# EAGLE design rfm12-breakout (EAGLE 6.5.0)
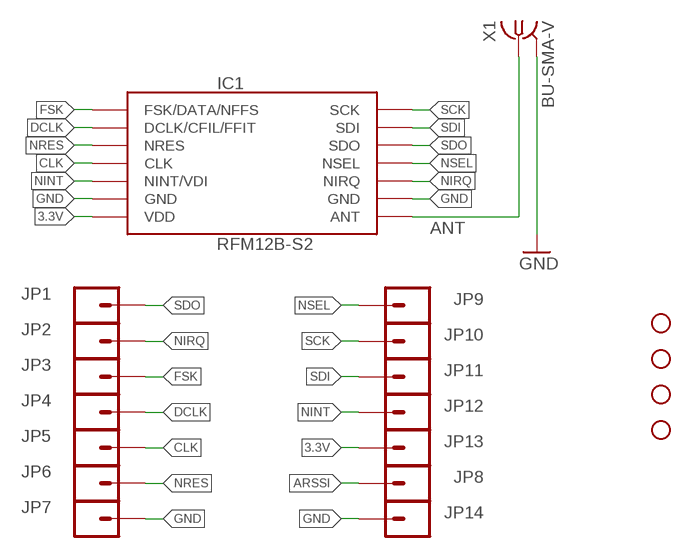
[diagram p0: schematic, sheet 1]

## Parts
IC1  RFM12B-S2  [RFM12B-S2]
JP1  M01  [1X01]
JP2  M01  [1X01]
JP3  M01  [1X01]
JP4  M01  [1X01]
JP5  M01  [1X01]
JP6  M01  [1X01]
JP7  M01  [1X01]
JP8  M01  [1X01]
JP9  M01  [1X01]
JP10  M01  [1X01]
JP11  M01  [1X01]
JP12  M01  [1X01]
JP13  M01  [1X01]
JP14  M01  [1X01]
STANDOFF1  STAND-OFF  [STAND-OFF]
STANDOFF2  STAND-OFF  [STAND-OFF]
STANDOFF3  STAND-OFF  [STAND-OFF]
STANDOFF4  STAND-OFF  [STAND-OFF]
X1  BU-SMA-V  [BU-SMA-V]

## Nets
3.3V: IC1.VDD JP13.1
ANT: IC1.ANT X1.1
ARSSI: JP8.1
CLK: IC1.CLK JP5.1
DCLK: IC1.DCLK/CFIL/FFIT JP4.1
FSK: IC1.FSK/DATA/NFFS JP3.1
GND: IC1.GND@1(GND) IC1.GND@2(GND) JP7.1 JP14.1 X1.2 X1.3 X1.4 X1.5
NINT: IC1.NINT/VDI JP12.1
NIRQ: IC1.NIRQ JP2.1
NRES: IC1.NRES JP6.1
NSEL: IC1.NSEL JP9.1
SCK: IC1.SCK JP10.1
SDI: IC1.SDI JP11.1
SDO: IC1.SDO JP1.1

## Library data of the parts
IC1 = Justin:RFM12B-S2
JP1-JP14 = Justin:M01
STANDOFF1-STANDOFF4 = SparkFun-Electromechanical:STAND-OFF: #4 Stand Off This is the mechanical footprint for a #4 phillips button head screw. Use the keepout ring to avoid running the screw head into surrounding components. SKU : PRT-00447
X1 = Justin:BU-SMA-V: FEMALE SMA CONNECTOR Radiall distributor RS 112-3794; OC_FARNELL: unknown; OC_NEWARK: unknown

## Board
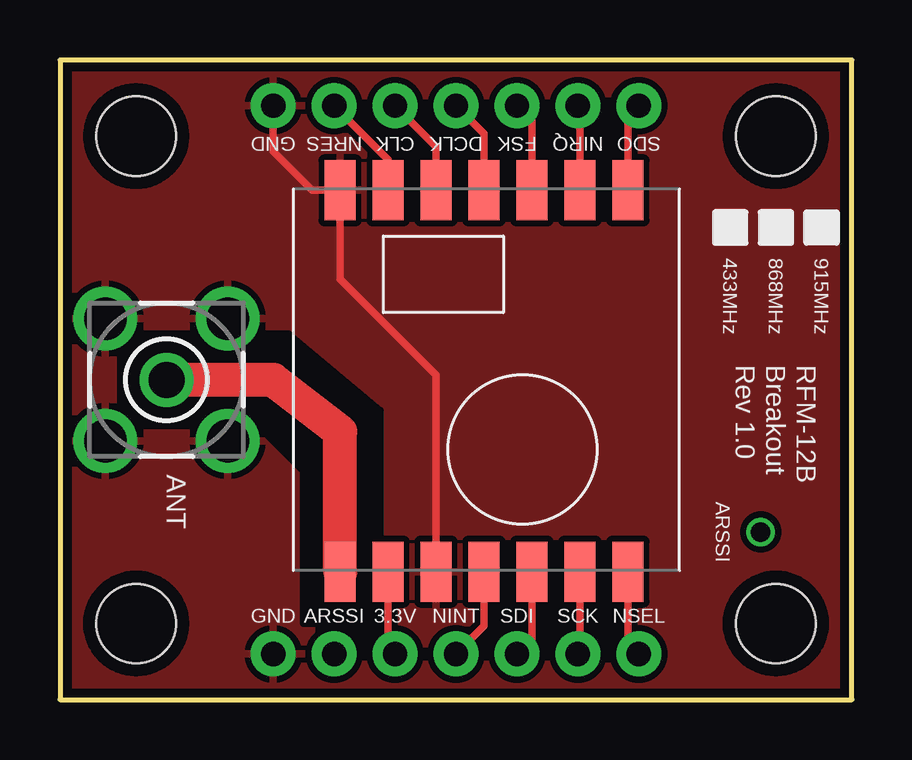
[diagram p1: board, top side]
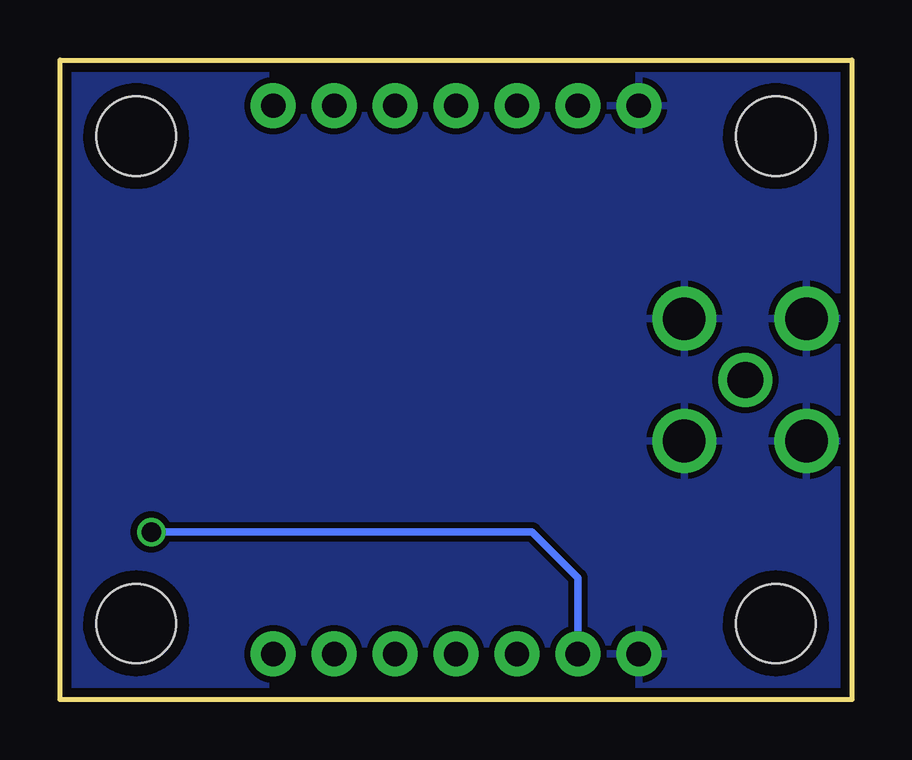
[diagram p2: board, bottom side, seen from below]

Size 33.02 x 26.67 mm. Coordinates in mm from the lower left corner, seen from the top.
Outline: 0,26.67 0,0 33.02,0 33.02,26.67 0,26.67
Copper layers (1*16): Top 0.0356mm / dielectric 1.5011mm / Bottom 0.0356mm
Design rules "LaenPCBOrder": minimum track width 6mil, minimum drill 13mil, track to track 6mil, track to pad 6mil, pad to pad 6mil, via to via 6mil, smd to smd 6mil, copper to edge 15mil, drill to drill 6mil, minimum pad ring 7mil, minimum via ring 7mil, stop-mask expansion 4mil, vias tented up to drill 0mil, thermal gap 10mil

### Footprints (pad centres in the part's own frame; a part is rotated, then mirrored left to right if it is on the bottom)
RFM12B-S2 = smd 2.5 x 1.3: ANT 8,-6.1; CLK -7.9,-2.1; DCLK/CFIL/FFIT -7.9,-0.1; FSK/DATA/NFFS -7.9,1.9; GND@1 -7.9,-6.1; GND@2 8,-2.1; NINT/VDI 8,-0.1; NIRQ -7.9,3.9; NRES -7.9,-4.1; NSEL 8,5.9; SCK 8,3.9; SDI 8,1.9; SDO -7.9,5.9; VDD 8,-4.1
1X01 = drill 1.016 pad 1.88: 1 0,0
STAND-OFF = hole 3.302: 0,0
BU-SMA-V = drill 1.5: 1 0,0 | drill 1.778: 2 -2.55,2.55; 3 2.55,2.55; 4 2.55,-2.55; 5 -2.55,-2.55

### Placement (x,y rotation side)
IC1  17.78,13.34 270 top
JP1  24.13,24.77 270 top
JP2  21.59,24.77 270 top
JP3  19.05,24.77 270 top
JP4  16.51,24.77 270 top
JP5  13.97,24.77 270 top
JP6  11.43,24.77 270 top
JP7  8.89,24.77 270 top
JP8  11.43,1.91 270 top
JP9  24.13,1.91 270 top
JP10  21.59,1.91 270 top
JP11  19.05,1.91 270 top
JP12  16.51,1.91 270 top
JP13  13.97,1.91 270 top
JP14  8.89,1.91 270 top
STANDOFF1  3.17,23.5 270 top
STANDOFF2  3.17,3.17 270 top
STANDOFF3  29.84,3.17 270 top
STANDOFF4  29.84,23.5 270 top
X1  4.45,13.34 270 top

### Tracks (layer width: path | path; a pad name or v marks a point on that pad's centre or on a via)
3.3V
  Top 0.305: IC1.VDD 13.68,2.19 JP13.1
ANT
  Top 1.422: IC1.ANT 11.68,11.18 8.89,13.34 X1.1
ARSSI  (via drill 0.8)
  Bottom 0.305: JP8.1 11.43,5.08 13.34,6.99 v29.21,6.99
CLK
  Top 0.305: IC1.CLK 15.68,23.05 JP5.1
DCLK
  Top 0.305: IC1.DCLK/CFIL/FFIT 17.68,23.59 JP4.1
FSK
  Top 0.305: IC1.FSK/DATA/NFFS 19.68,24.14 JP3.1
GND
  Top 0.305: IC1.GND@2 15.68,13.53 11.68,17.53 IC1.GND@1 10.52,21.23 8.89,22.86 JP7.1
  pour Bottom (isolate 0.254): 33.02,26.67 0,26.67 0,0 33.02,0
  pour Top (isolate 0.254): 33.02,26.67 0,26.67 0,0 33.02,0
N$1
  cutout Top: 2.54,15.24 9.53,15.24 13.34,12.06 13.34,3.17 10.16,3.17 10.16,9.53 8.26,11.43 2.54,11.43
NINT
  Top 0.305: IC1.NINT/VDI 17.68,3.08 JP12.1
NIRQ
  Top 0.305: IC1.NIRQ 21.68,24.68 JP2.1
NRES
  Top 0.305: IC1.NRES 13.68,22.52 JP6.1
NSEL
  Top 0.305: IC1.NSEL 23.68,2.35 JP9.1
SCK
  Top 0.305: IC1.SCK 21.68,2 JP10.1
SDI
  Top 0.305: IC1.SDI 19.68,2.54 JP11.1
SDO
  Top 0.305: IC1.SDO 23.68,24.32 JP1.1

### Text on the board
_tsilk: GND | NRES | CLK | DCLK | FSK | NIRQ | SDO | 433MHz | 868MHz | 915MHz | Rev 1.0 | Breakout | RFM-12B | ANT | ARSSI | GND | ARSSI | 3.3V | NINT | SDI | SCK | NSEL